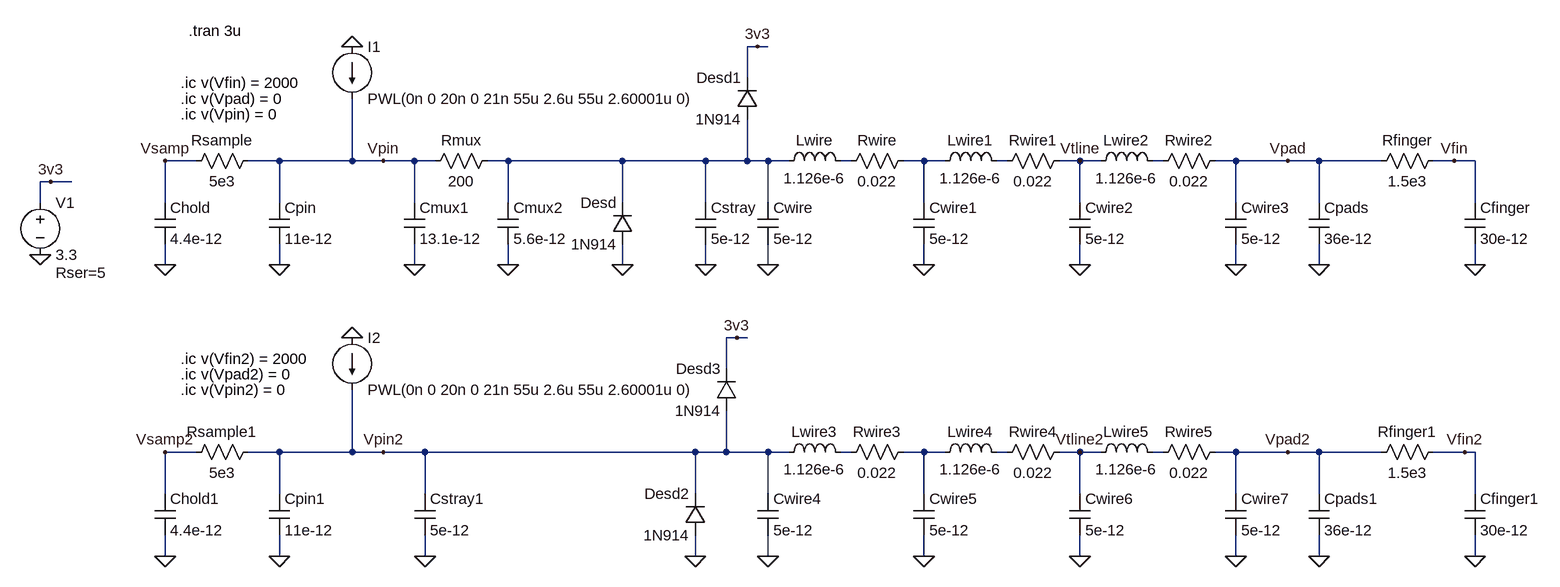
[diagram p0: schematic TouchInputESD.asc]
TouchInputESD.asc, the LTspice schematic file:
Version 4
SHEET 1 2296 740
WIRE 960 -112 944 -112
WIRE 976 -112 960 -112
WIRE 944 -64 944 -112
WIRE 96 64 48 64
WIRE 224 64 176 64
WIRE 336 64 336 -32
WIRE 336 64 224 64
WIRE 384 64 336 64
WIRE 432 64 384 64
WIRE 464 64 432 64
WIRE 576 64 544 64
WIRE 752 64 576 64
WIRE 880 64 752 64
WIRE 944 64 944 0
WIRE 944 64 880 64
WIRE 976 64 944 64
WIRE 1008 64 976 64
WIRE 1104 64 1088 64
WIRE 1216 64 1184 64
WIRE 1248 64 1216 64
WIRE 1344 64 1328 64
WIRE 1456 64 1424 64
WIRE 1488 64 1456 64
WIRE 1584 64 1568 64
WIRE 1696 64 1664 64
WIRE 1776 64 1696 64
WIRE 1824 64 1776 64
WIRE 1920 64 1824 64
WIRE 2032 64 2000 64
WIRE 2064 64 2032 64
WIRE -128 96 -144 96
WIRE -96 96 -128 96
WIRE -144 128 -144 96
WIRE 48 128 48 64
WIRE 224 128 224 64
WIRE 432 128 432 64
WIRE 576 128 576 64
WIRE 752 128 752 64
WIRE 880 128 880 64
WIRE 976 128 976 64
WIRE 1216 128 1216 64
WIRE 1456 128 1456 64
WIRE 1696 128 1696 64
WIRE 1824 128 1824 64
WIRE 2064 128 2064 64
WIRE 48 224 48 192
WIRE 224 224 224 192
WIRE 432 224 432 192
WIRE 576 224 576 192
WIRE 752 224 752 192
WIRE 880 224 880 192
WIRE 976 224 976 192
WIRE 1216 224 1216 192
WIRE 1456 224 1456 192
WIRE 1696 224 1696 192
WIRE 1824 224 1824 192
WIRE 2064 224 2064 192
WIRE 928 336 912 336
WIRE 944 336 928 336
WIRE 912 384 912 336
WIRE 96 512 48 512
WIRE 224 512 176 512
WIRE 336 512 336 416
WIRE 336 512 224 512
WIRE 384 512 336 512
WIRE 448 512 384 512
WIRE 864 512 448 512
WIRE 912 512 912 448
WIRE 912 512 864 512
WIRE 976 512 912 512
WIRE 1008 512 976 512
WIRE 1104 512 1088 512
WIRE 1216 512 1184 512
WIRE 1248 512 1216 512
WIRE 1344 512 1328 512
WIRE 1456 512 1424 512
WIRE 1488 512 1456 512
WIRE 1584 512 1568 512
WIRE 1696 512 1664 512
WIRE 1776 512 1696 512
WIRE 1824 512 1776 512
WIRE 1920 512 1824 512
WIRE 2048 512 2000 512
WIRE 2064 512 2048 512
WIRE 48 576 48 512
WIRE 224 576 224 512
WIRE 448 576 448 512
WIRE 864 576 864 512
WIRE 976 576 976 512
WIRE 1216 576 1216 512
WIRE 1456 576 1456 512
WIRE 1696 576 1696 512
WIRE 1824 576 1824 512
WIRE 2064 576 2064 512
WIRE 48 672 48 640
WIRE 224 672 224 640
WIRE 448 672 448 640
WIRE 864 672 864 640
WIRE 976 672 976 640
WIRE 1216 672 1216 640
WIRE 1456 672 1456 640
WIRE 1696 672 1696 640
WIRE 1824 672 1824 640
WIRE 2064 672 2064 640
FLAG 48 224 0
FLAG 224 224 0
FLAG 432 224 0
FLAG 576 224 0
FLAG 976 224 0
FLAG 1216 224 0
FLAG 1456 224 0
FLAG 1696 224 0
FLAG 1824 224 0
FLAG 2064 224 0
FLAG 336 -112 0
FLAG 384 64 Vpin
FLAG 1776 64 Vpad
FLAG 48 672 0
FLAG 224 672 0
FLAG 976 672 0
FLAG 1216 672 0
FLAG 1456 672 0
FLAG 1696 672 0
FLAG 1824 672 0
FLAG 2064 672 0
FLAG 336 336 0
FLAG 384 512 Vpin2
FLAG 1776 512 Vpad2
FLAG 880 224 0
FLAG 448 672 0
FLAG 48 64 Vsamp
FLAG 48 512 Vsamp2
FLAG 752 224 0
FLAG -144 208 0
FLAG -128 96 3v3
FLAG 960 -112 3v3
FLAG 864 672 0
FLAG 928 336 3v3
FLAG 2032 64 Vfin
FLAG 2048 512 Vfin2
FLAG 1456 64 Vtline
FLAG 1456 512 Vtline2
SYMBOL cap 32 128 R0
SYMATTR InstName Chold
SYMATTR Value 4.4e-12
SYMBOL cap 208 128 R0
SYMATTR InstName Cpin
SYMATTR Value 11e-12
SYMBOL res 192 48 R90
WINDOW 0 0 56 VBottom 2
WINDOW 3 32 56 VTop 2
SYMATTR InstName Rsample
SYMATTR Value 5e3
SYMBOL cap 416 128 R0
SYMATTR InstName Cmux1
SYMATTR Value 13.1e-12
SYMBOL cap 560 128 R0
SYMATTR InstName Cmux2
SYMATTR Value 5.6e-12
SYMBOL res 560 48 R90
WINDOW 0 0 56 VBottom 2
WINDOW 3 32 56 VTop 2
SYMATTR InstName Rmux
SYMATTR Value 200
SYMBOL ind 992 80 R270
WINDOW 0 32 56 VTop 2
WINDOW 3 5 56 VBottom 2
SYMATTR InstName Lwire
SYMATTR Value 1.126e-6
SYMBOL res 1200 48 R90
WINDOW 0 0 56 VBottom 2
WINDOW 3 32 56 VTop 2
SYMATTR InstName Rwire
SYMATTR Value 0.022
SYMBOL cap 960 128 R0
SYMATTR InstName Cwire
SYMATTR Value 5e-12
SYMBOL ind 1232 80 R270
WINDOW 0 32 56 VTop 2
WINDOW 3 5 56 VBottom 2
SYMATTR InstName Lwire1
SYMATTR Value 1.126e-6
SYMBOL res 1440 48 R90
WINDOW 0 0 56 VBottom 2
WINDOW 3 32 56 VTop 2
SYMATTR InstName Rwire1
SYMATTR Value 0.022
SYMBOL cap 1200 128 R0
SYMATTR InstName Cwire1
SYMATTR Value 5e-12
SYMBOL ind 1472 80 R270
WINDOW 0 32 56 VTop 2
WINDOW 3 5 56 VBottom 2
SYMATTR InstName Lwire2
SYMATTR Value 1.126e-6
SYMBOL res 1680 48 R90
WINDOW 0 0 56 VBottom 2
WINDOW 3 32 56 VTop 2
SYMATTR InstName Rwire2
SYMATTR Value 0.022
SYMBOL cap 1440 128 R0
SYMATTR InstName Cwire2
SYMATTR Value 5e-12
SYMBOL cap 1680 128 R0
SYMATTR InstName Cwire3
SYMATTR Value 5e-12
SYMBOL cap 1808 128 R0
SYMATTR InstName Cpads
SYMATTR Value 36e-12
SYMBOL res 2016 48 R90
WINDOW 0 0 56 VBottom 2
WINDOW 3 32 56 VTop 2
SYMATTR InstName Rfinger
SYMATTR Value 1.5e3
SYMBOL cap 2048 128 R0
SYMATTR InstName Cfinger
SYMATTR Value 30e-12
SYMBOL current 336 -112 R0
WINDOW 123 0 0 Left 2
WINDOW 39 0 0 Left 2
SYMATTR InstName I1
SYMATTR Value PWL(0n 0 20n 0 21n 55u 2.6u 55u 2.60001u 0)
SYMBOL cap 32 576 R0
SYMATTR InstName Chold1
SYMATTR Value 4.4e-12
SYMBOL cap 208 576 R0
SYMATTR InstName Cpin1
SYMATTR Value 11e-12
SYMBOL res 192 496 R90
WINDOW 0 0 56 VBottom 2
WINDOW 3 32 56 VTop 2
SYMATTR InstName Rsample1
SYMATTR Value 5e3
SYMBOL ind 992 528 R270
WINDOW 0 32 56 VTop 2
WINDOW 3 5 56 VBottom 2
SYMATTR InstName Lwire3
SYMATTR Value 1.126e-6
SYMBOL res 1200 496 R90
WINDOW 0 0 56 VBottom 2
WINDOW 3 32 56 VTop 2
SYMATTR InstName Rwire3
SYMATTR Value 0.022
SYMBOL cap 960 576 R0
SYMATTR InstName Cwire4
SYMATTR Value 5e-12
SYMBOL ind 1232 528 R270
WINDOW 0 32 56 VTop 2
WINDOW 3 5 56 VBottom 2
SYMATTR InstName Lwire4
SYMATTR Value 1.126e-6
SYMBOL res 1440 496 R90
WINDOW 0 0 56 VBottom 2
WINDOW 3 32 56 VTop 2
SYMATTR InstName Rwire4
SYMATTR Value 0.022
SYMBOL cap 1200 576 R0
SYMATTR InstName Cwire5
SYMATTR Value 5e-12
SYMBOL ind 1472 528 R270
WINDOW 0 32 56 VTop 2
WINDOW 3 5 56 VBottom 2
SYMATTR InstName Lwire5
SYMATTR Value 1.126e-6
SYMBOL res 1680 496 R90
WINDOW 0 0 56 VBottom 2
WINDOW 3 32 56 VTop 2
SYMATTR InstName Rwire5
SYMATTR Value 0.022
SYMBOL cap 1440 576 R0
SYMATTR InstName Cwire6
SYMATTR Value 5e-12
SYMBOL cap 1680 576 R0
SYMATTR InstName Cwire7
SYMATTR Value 5e-12
SYMBOL cap 1808 576 R0
SYMATTR InstName Cpads1
SYMATTR Value 36e-12
SYMBOL res 2016 496 R90
WINDOW 0 0 56 VBottom 2
WINDOW 3 32 56 VTop 2
SYMATTR InstName Rfinger1
SYMATTR Value 1.5e3
SYMBOL cap 2048 576 R0
SYMATTR InstName Cfinger1
SYMATTR Value 30e-12
SYMBOL current 336 336 R0
WINDOW 123 0 0 Left 2
WINDOW 39 0 0 Left 2
SYMATTR InstName I2
SYMATTR Value PWL(0n 0 20n 0 21n 55u 2.6u 55u 2.60001u 0)
SYMBOL cap 864 128 R0
SYMATTR InstName Cstray
SYMATTR Value 5e-12
SYMBOL cap 432 576 R0
SYMATTR InstName Cstray1
SYMATTR Value 5e-12
SYMBOL diode 768 192 R180
WINDOW 0 24 64 Left 2
WINDOW 3 24 0 Left 2
SYMATTR InstName Desd
SYMATTR Value 1N914
SYMBOL diode 960 0 R180
WINDOW 0 24 64 Left 2
WINDOW 3 24 0 Left 2
SYMATTR InstName Desd1
SYMATTR Value 1N914
SYMBOL voltage -144 112 R0
WINDOW 123 0 0 Left 2
WINDOW 39 24 124 Left 2
SYMATTR InstName V1
SYMATTR Value 3.3
SYMATTR SpiceLine Rser=5
SYMBOL diode 880 640 R180
WINDOW 0 24 64 Left 2
WINDOW 3 24 0 Left 2
SYMATTR InstName Desd2
SYMATTR Value 1N914
SYMBOL diode 928 448 R180
WINDOW 0 24 64 Left 2
WINDOW 3 24 0 Left 2
SYMATTR InstName Desd3
SYMATTR Value 1N914
TEXT 84 -136 Left 2 !.tran 3u
TEXT 72 -32 Left 2 !.ic v(Vpad) = 0
TEXT 72 416 Left 2 !.ic v(Vpin2) = 0
TEXT 72 -8 Left 2 !.ic v(Vpin) = 0
TEXT 72 -56 Left 2 !.ic v(Vfin) = 2000
TEXT 72 392 Left 2 !.ic v(Vpad2) = 0
TEXT 72 368 Left 2 !.ic v(Vfin2) = 2000

The netlist it stands for:
* TouchInputESD.asc
Chold Vsamp 0 4.4e-12
Cpin Vpin 0 11e-12
Rsample Vpin Vsamp 5e3
Cmux1 Vpin 0 13.1e-12
Cmux2 N001 0 5.6e-12
Rmux N001 Vpin 200
Lwire N001 N002 1.126e-6
Rwire N003 N002 0.022
Cwire N001 0 5e-12
Lwire1 N003 N004 1.126e-6
Rwire1 Vtline N004 0.022
Cwire1 N003 0 5e-12
Lwire2 Vtline N005 1.126e-6
Rwire2 Vpad N005 0.022
Cwire2 Vtline 0 5e-12
Cwire3 Vpad 0 5e-12
Cpads Vpad 0 36e-12
Rfinger Vfin Vpad 1.5e3
Cfinger Vfin 0 30e-12
I1 0 Vpin PWL(0n 0 20n 0 21n 55u 2.6u 55u 2.60001u 0)
Chold1 Vsamp2 0 4.4e-12
Cpin1 Vpin2 0 11e-12
Rsample1 Vpin2 Vsamp2 5e3
Lwire3 Vpin2 N006 1.126e-6
Rwire3 N007 N006 0.022
Cwire4 Vpin2 0 5e-12
Lwire4 N007 N008 1.126e-6
Rwire4 Vtline2 N008 0.022
Cwire5 N007 0 5e-12
Lwire5 Vtline2 N009 1.126e-6
Rwire5 Vpad2 N009 0.022
Cwire6 Vtline2 0 5e-12
Cwire7 Vpad2 0 5e-12
Cpads1 Vpad2 0 36e-12
Rfinger1 Vfin2 Vpad2 1.5e3
Cfinger1 Vfin2 0 30e-12
I2 0 Vpin2 PWL(0n 0 20n 0 21n 55u 2.6u 55u 2.60001u 0)
Cstray N001 0 5e-12
Cstray1 Vpin2 0 5e-12
Desd 0 N001 1N914
Desd1 N001 3v3 1N914
V1 3v3 0 3.3 Rser=5
Desd2 0 Vpin2 1N914
Desd3 Vpin2 3v3 1N914
.model D D
.lib standard.dio
.tran 3u
.ic v(Vpad) = 0
.ic v(Vpin2) = 0
.ic v(Vpin) = 0
.ic v(Vfin) = 2000
.ic v(Vpad2) = 0
.ic v(Vfin2) = 2000
.backanno
.end